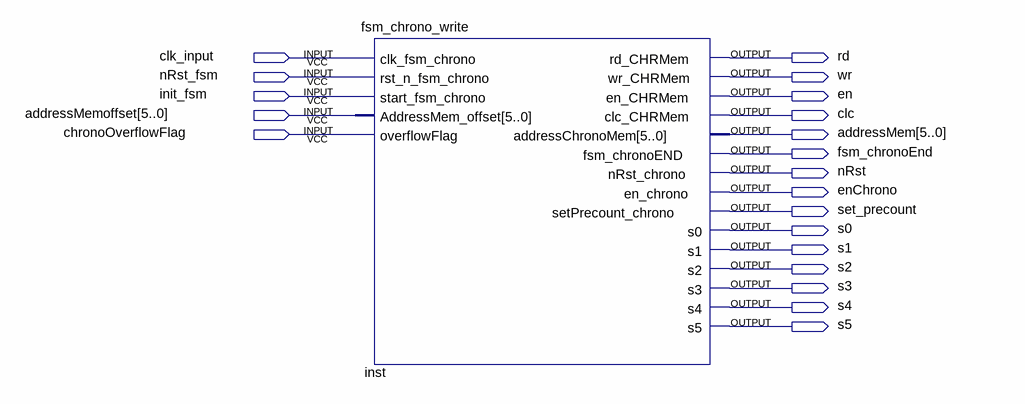
[diagram p0: schematic sheet]
// Quartus schematic fsmChronoTest.bdf as structural Verilog: 1 symbols, 20 pins
module fsmChronoTest (
  input  clk_input,
  input  nRst_fsm,
  input  init_fsm,
  input  [5:0] addressMemoffset,
  input  chronoOverflowFlag,
  output rd,
  output wr,
  output en,
  output clc,
  output [5:0] addressMem,
  output fsm_chronoEnd,
  output nRst,
  output enChrono,
  output set_precount,
  output s0,
  output s1,
  output s2,
  output s3,
  output s4,
  output s5
);

  fsm_chrono_write inst (
    .clk_fsm_chrono(clk_input), .rst_n_fsm_chrono(nRst_fsm), .start_fsm_chrono(init_fsm),
    .AddressMem_offset(addressMemoffset), .overflowFlag(chronoOverflowFlag), .rd_CHRMem(rd), .wr_CHRMem(wr),
    .en_CHRMem(en), .clc_CHRMem(clc), .addressChronoMem(addressMem), .fsm_chronoEND(fsm_chronoEnd),
    .nRst_chrono(nRst), .en_chrono(enChrono), .setPrecount_chrono(set_precount), .s0(s0), .s1(s1), .s2(s2),
    .s3(s3), .s4(s4), .s5(s5));
endmodule
